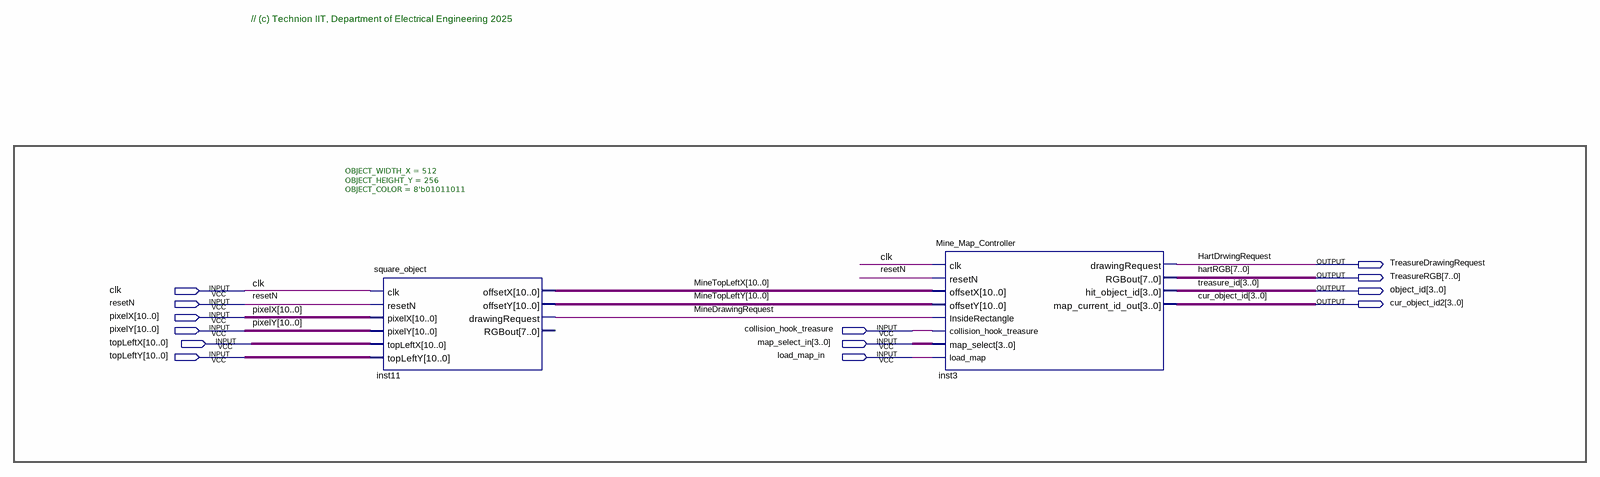
[diagram p0: schematic sheet]
// Quartus schematic MINE_DISPLAY.bdf as structural Verilog: 2 symbols, 13 pins
module MINE_DISPLAY (
  input  clk,
  input  resetN,
  input  [10:0] pixelX,
  input  [10:0] pixelY,
  input  collision_hook_treasure,
  input  [10:0] topLeftX,
  input  [3:0] map_select_in,
  input  [10:0] topLeftY,
  input  load_map_in,
  output TreasureDrawingRequest,
  output [7:0] TreasureRGB,
  output [3:0] object_id,
  output [3:0] cur_object_id2
);

  wire MineDrawingRequest;
  wire [10:0] MineTopLeftX, MineTopLeftY;

  square_object #(.OBJECT_WIDTH_X(512), .OBJECT_HEIGHT_Y(256), .OBJECT_COLOR(8'b01011011)) inst11 (
    .clk(clk), .resetN(resetN), .pixelX(pixelX), .pixelY(pixelY), .topLeftX(topLeftX), .topLeftY(topLeftY),
    .offsetX(MineTopLeftX), .offsetY(MineTopLeftY), .drawingRequest(MineDrawingRequest));  // open: RGBout
  Mine_Map_Controller inst3 (
    .clk(clk), .resetN(resetN), .offsetX(MineTopLeftX), .offsetY(MineTopLeftY),
    .InsideRectangle(MineDrawingRequest), .collision_hook_treasure(collision_hook_treasure),
    .map_select(map_select_in), .load_map(load_map_in), .drawingRequest(TreasureDrawingRequest),
    .RGBout(TreasureRGB), .hit_object_id(object_id), .map_current_id_out(cur_object_id2));

  // Other names for the same wires on the sheet: cur_object_id[3:0] = cur_object_id2;
  //   HartDrwingRequest = TreasureDrawingRequest; hartRGB[7:0] = TreasureRGB; treasure_id[3:0] = object_id

  // Notes on the sheet:
  //   // (c) Technion IIT, Department of Electrical Engineering 2025
endmodule
